# Altium schematic sheet V stuff.SchDoc
size A4
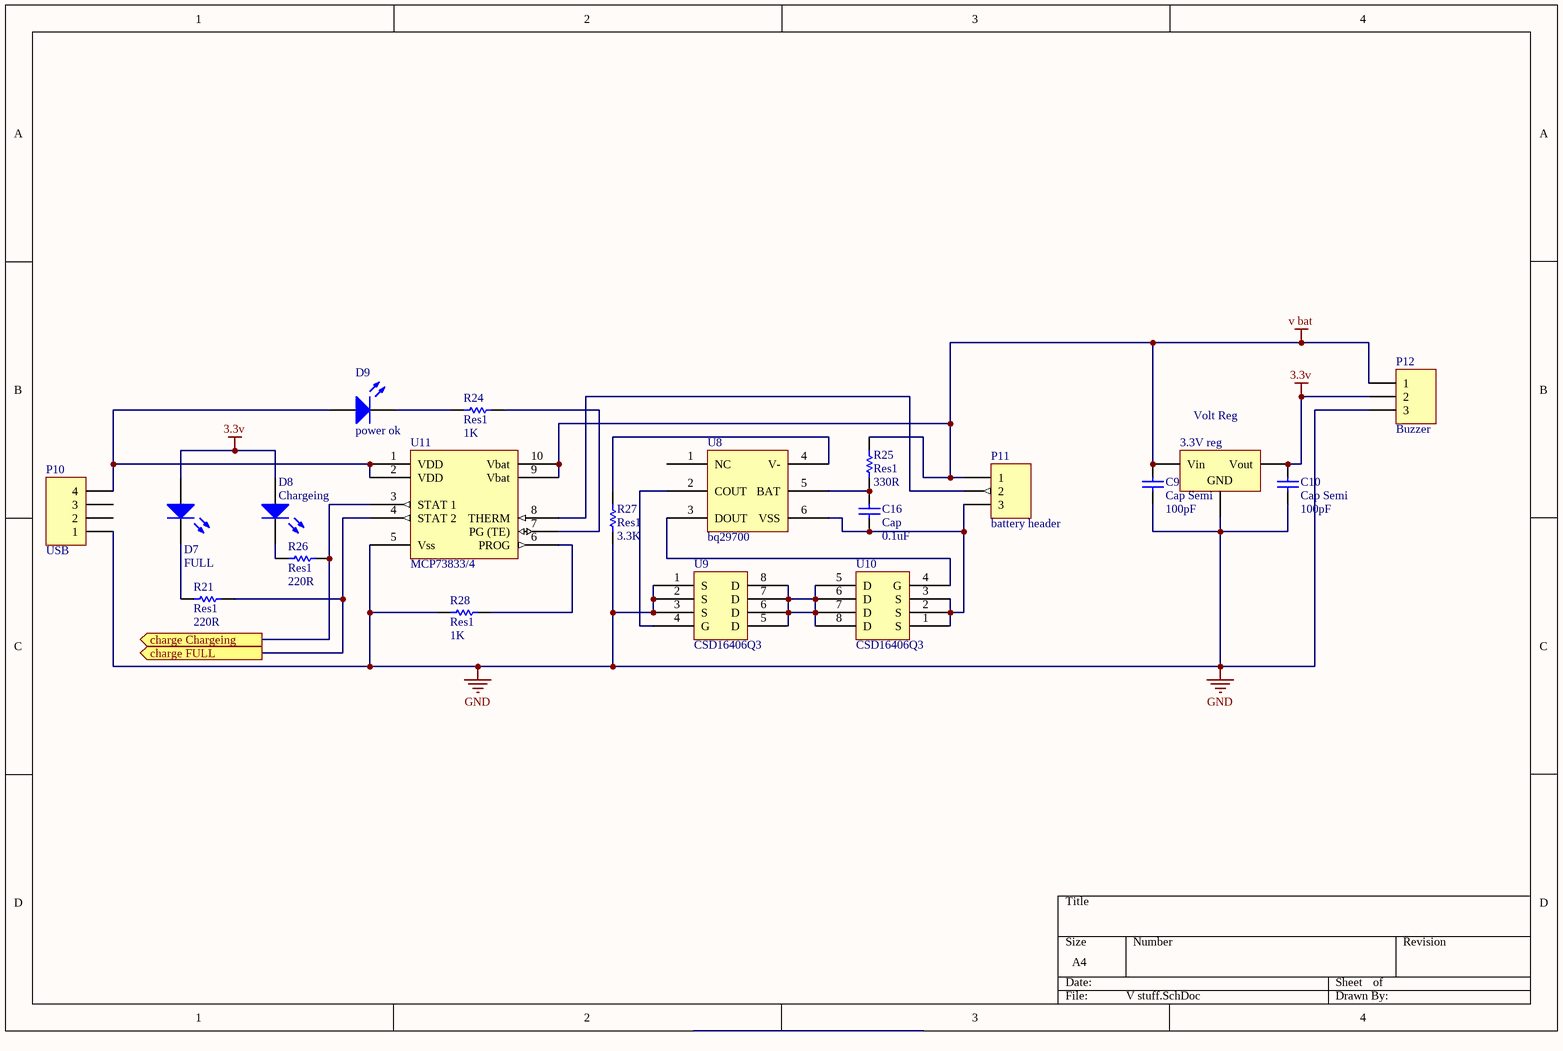
[diagram p0: V stuff.SchDoc]

## Parts
3.3V_reg  Volt Reg  [SOT23_M]
C9  Cap Semi  value 100pF  [C1206]
C10  Cap Semi  value 100pF  [C1206]
C16  Cap  value 0.1uF  [J1-0603]
D7  FULL  [J1-0603]
D8  Chargeing  [J1-0603]
D9  power ok  [J1-0603]
P10  USB  [HDR1X4]
P11  battery header  [HDR1X3]
P12  Buzzer  [HDR1X2]
R21  Res1  value 220R  [0402]
R24  Res1  value 1K  [0402]
R25  Res1  value 330R  [0402]
R26  Res1  value 220R  [0402]
R27  Res1  value 3.3K  [0402]
R28  Res1  value 1K  [0402]
U8  bq29700  [DSE]
U9  CSD16406Q3  [Q3]
U10  CSD16406Q3  [Q3]
U11  MCP73833/4  [SOP10]

## Ports
charge Chargeing (out), charge FULL (out)

## Nets
3.3v: 3.3V_reg.3(Vout) C10.2 D7.1(A) D8.1(A) P12.2
GND: 3.3V_reg.2(GND) C9.1 C10.1 P10.1 P12.3 R27.2 R28.1 U9.1(S) U9.2(S) U9.3(S) U11.5(Vss)
v bat: 3.3V_reg.1(Vin) C9.2 P11.1 P12.1 R25.1 U11.9(Vbat) U11.10(Vbat)
charge Chargeing: R26.2 U11.3(STAT_1) ; port charge Chargeing
charge FULL: R21.2 U11.4(STAT_2) ; port charge FULL
NetC16_1: C16.1 P11.3 U8.6(VSS) U10.1(S) U10.2(S) U10.3(S)
NetC16_2: C16.2 R25.2 U8.5(BAT)
NetD7_2: D7.2(K) R21.1
NetD8_2: D8.2(K) R26.1
NetD9_1: D9.1(A) P10.4 U11.1(VDD) U11.2(VDD)
NetD9_2: D9.2(K) R24.1
NetP11_2: P11.2 U11.8(THERM)
NetR24_2: R24.2 U11.7(PG_(TE))
NetR27_1: R27.1 U8.4(V-)
NetR28_2: R28.2 U11.6(PROG)
NetU8_2: U8.2(COUT) U9.4(G)
NetU8_3: U8.3(DOUT) U10.4(G)
NetU9_5: U9.5(D) U9.6(D) U9.7(D) U9.8(D) U10.5(D) U10.6(D) U10.7(D) U10.8(D)

Not connected (* = marked no-connect by the designer): P10 2 3; U8 1(NC)

## Library data of the parts
3.3V_reg = Volt Reg: Voltage Regulator; Published: 24-Mar-1999; LatestRevisionDate: 29-May-2009; LatestRevisionNote: IPC-7351 Footprint Added.; PackageReference: D2PAK; Publisher: Altium Limited; PackageDescription: 3-Pin Transistor Outline Package 2.54 mm Pitch, 15.1 mm Lead Span
C9 C10 = Cap Semi: Capacitor (Semiconductor SIM Model); Published: 8-Jun-2000; LatestRevisionDate: 29-May-2009; LatestRevisionNote: IPC-7351 Footprint Added.; PackageReference: C1206; Publisher: Altium Limited; PackageDescription: Chip Capacitor
C16 = Cap: Capacitor; Published: 8-Jun-2000; LatestRevisionDate: 17-Jul-2002; LatestRevisionNote: Re-released for DXP Platform.; PackageReference: RAD-0.3; Publisher: Altium Limited; PackageDescription: Radial Cap, Thru-Hole; 2 Leads; 0.3 in Pin Spacing
D7-D9 = LED1: Typical RED GaAs LED; Published: 8-Jun-2000; LatestRevisionDate: 08-Jul-2005; LatestRevisionNote: Mech Layer 1 removed.; PackageReference: LED-1; Publisher: Altium Limited; PackageDescription: LED; 2 Leads
P10 = Header 4: Header, 4-Pin; LatestRevisionDate: 17-Jul-2002; LatestRevisionNote: Re-released for DXP Platform.; Publisher: Altium Limited
P11 P12 = Header 3: Header, 3-Pin; LatestRevisionDate: 17-Jul-2002; LatestRevisionNote: Re-released for DXP Platform.; Publisher: Altium Limited
R21 R24-R28 = Res1: Resistor; Published: 8-Jun-2000; LatestRevisionDate: 17-Jul-2002; LatestRevisionNote: Re-released for DXP Platform.; PackageReference: AXIAL-0.3; Publisher: Altium Limited; PackageDescription: Axial Device, Thru-Hole; 2 Leads; 0.3 in Pin Spacing
U8-U11 = Component_1